# EAGLE design ATSAM11_01 (EAGLE 9.1.0)
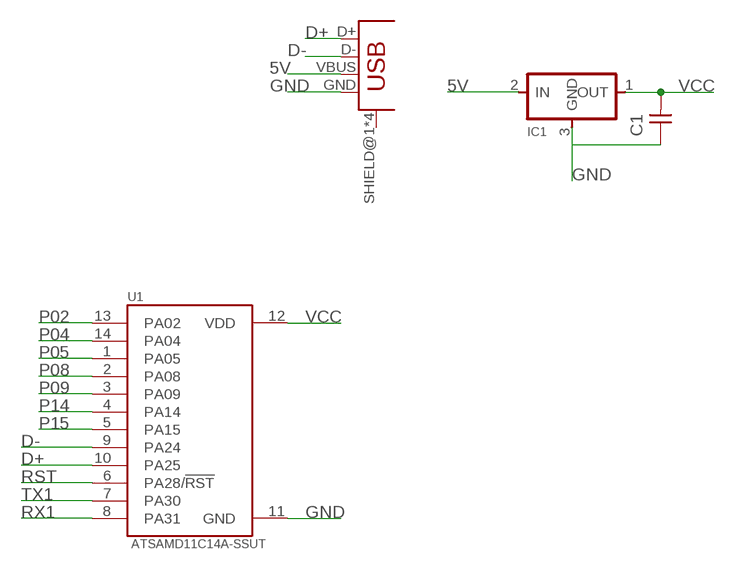
[diagram p0: schematic, sheet 1]

## Parts
C1  CAP-UNPOLARIZED  [C1206]
IC1  VR_REGULATOR-SOT23SOT23  [SOT23]
U1  ATSAMD11C14A-SSUT  [SOIC127P600X160-14N]
U$1  CONN_USB_MINIB  [USB_MINIB]

## Nets
5V: IC1.2(IN) U$1.VBUS
D+: U1.10(PA25) U$1.D+
D-: U1.9(PA24) U$1.D-
GND: C1.1 IC1.3(GND) U1.11(GND) U$1.GND
P02: U1.13(PA02)
P04: U1.14(PA04)
P05: U1.1(PA05)
P08: U1.2(PA08)
P09: U1.3(PA09)
P14: U1.4(PA14)
P15: U1.5(PA15)
RST: U1.6(PA28/!RST)
RX1: U1.8(PA31)
TX1: U1.7(PA30)
VCC: C1.2 IC1.1(OUT) U1.12(VDD)
Unconnected: U$1.SHIELD@1(SHIELD) U$1.SHIELD@2(SHIELD) U$1.SHIELD@3(SHIELD) U$1.SHIELD@4(SHIELD)

## Library data of the parts
C1 = fab:CAP-UNPOLARIZED
IC1 = fab:VR_REGULATOR-SOT23
U1 = ATSAMD11C14A-SSUT:ATSAMD11C14A-SSUT: MCU 32-Bit SAM D11 ARM Cortex M0+ RISC 16KB Flash 1.8V/2.5V/3.3V 14-Pin SOIC T/R; AVAILABILITY: Unavailable; DESCRIPTION: Cortex-M0+, 16KB FLASH, 4KB SRAM, USB - 14 SOIC, INDUSTRIAL, GREEN, 1.6-3.6V, 48MHz/ SOIC .150 _SS_; MF: Microchip; MP: ATSAMD11C14A-SSUT; PACKAGE: SOIC-14 Microchip; PRICE: None
U$1 = fab:CONN_USB_MINIB

## Board
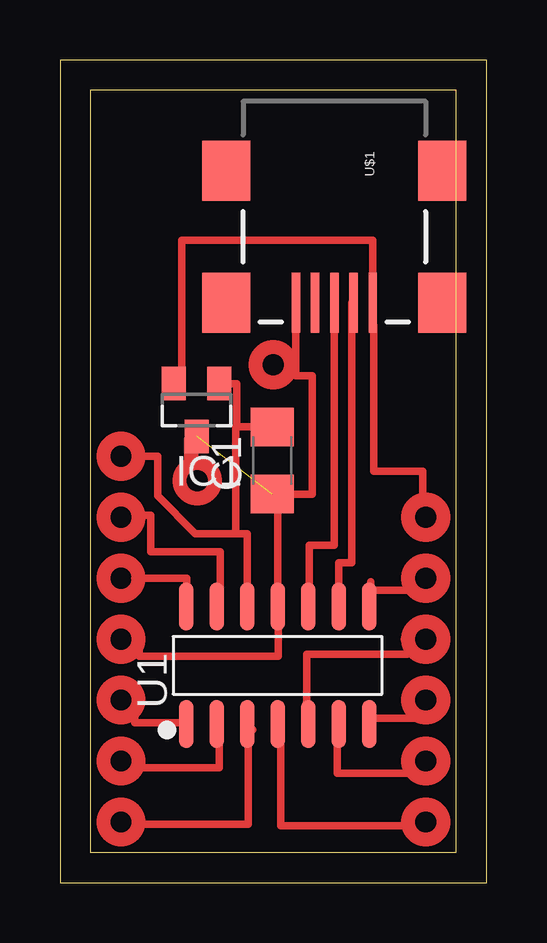
[diagram p1: board, top side]

Size 17.78 x 34.29 mm. Coordinates in mm from the lower left corner, seen from the top.
Outline: 0,0 17.78,0 17.78,34.29 0,34.29 0,0
Copper layers (1*16): Top 0.035mm / dielectric 1.5mm / Bottom 0.035mm
Design rules "default *": minimum track width 10mil, minimum drill 24mil, track to track 16mil, track to pad 16mil, pad to pad 8mil, via to via 8mil, smd to smd 16mil, copper to edge 40mil, drill to drill 8mil, minimum pad ring 10mil, minimum via ring 8mil, stop-mask expansion 4mil, vias tented up to drill 0mil, thermal gap 10mil
Milling: area 1.3,1.3 to 16.5,33

### Footprints (pad centres in the part's own frame; a part is rotated, then mirrored left to right if it is on the bottom)
C1206 = smd 1.6 x 1.8: 1 -1.4,0; 2 1.4,0
SOT23 = smd 1 x 1.4: 1 -0.95,-1.1; 2 0.95,-1.1; 3 0,1.1
SOIC127P600X160-14N = smd 2 x 0.6: 1 -2.45,3.81; 2 -2.45,2.54; 3 -2.45,1.27; 4 -2.45,0; 5 -2.45,-1.27; 6 -2.45,-2.54; 7 -2.45,-3.81; 8 2.45,-3.81; 9 2.45,-2.54; 10 2.45,-1.27; 11 2.45,0; 12 2.45,1.27; 13 2.45,2.54; 14 2.45,3.81
USB_MINIB = smd 2.5 x 0.35: D+ 3.77,0; D- 3.77,0.8; GND 3.77,-1.6; ID 3.77,-0.8; VBUS 3.77,1.6 | smd 2.5 x 2: SHIELD@1 -1.73,-4.5; SHIELD@2 -1.73,4.5; SHIELD@3 3.77,4.5; SHIELD@4 3.77,-4.5

### Placement (x,y rotation side)
C1  8.84,17.6 90 top
IC1  5.69,19.71 180 top
U1  9.07,9.07 90 top
U$1  11.43,27.94 270 top

### Tracks (layer width: path | path; a pad name or v marks a point on that pad's centre or on a via)
5V
  Top 0.305: U$1.VBUS 13.03,26.77 5.08,26.77 | 5.94,26.77 5.08,26.77 | 4.72,20.83 IC1.2 5.08,20.81 5.08,26.77
D+
  Top 0.305: 10.39,11.52 U1.10 10.39,11.52 | U$1.D+ 11.43,14.07 10.39,14.07 10.39,11.52
D-
  Top 0.305: 11.56,11.52 U1.9 11.61,13.34 12.16,13.34 12.16,24.17 U$1.D-
GND  (1 unrouted)
  Top 0.305: U$1.GND 9.83,21.97 | 9.83,21.97 9.83,21.13 10.52,21.13 10.52,16.2 8.99,16.2 | 8.99,16.2 C1.1 | U1.11 9.07,16.2 8.99,16.2 | IC1.3 5.69,19.14 | 9.83,22.09 9.83,21.97
N$1
  Top 0.305: 3.43,2.44 7.85,2.44 7.85,6.63 7.85,6.38 8.03,6.38
N$2
  Top 0.305: 9.2,6.58 9.2,2.39 14.5,2.39
N$3
  Top 0.305: 6.63,6.5 6.63,4.8 3.17,4.8 3.2,4.8 3.2,4.83
N$4
  Top 0.305: 11.56,5.84 11.56,4.57 14.86,4.57
N$5
  Top 0.305: 14.55,7.47 14.55,7.57
N$6
  Top 0.305: 12.83,12.19 14.61,12.19 14.61,12.57
N$7
  Top 0.305: 5.21,6.68 3.12,6.68 3.12,7.11
N$8
  Top 0.305: 12.95,12.06 12.95,12.55
N$9
  Top 0.305: 3.3,9.83 3.3,9.45 3.76,9.45 4.37,9.45 9.09,9.45 9.09,10.74
N$10
  Top 0.305: 5.28,11.86 5.28,12.7 3.12,12.7
N$11
  Top 0.305: 6.68,11.79 6.68,13.79 3.79,13.79 3.79,15.32 3.3,15.32
N$12
  Top 0.305: 12.95,6.86 15.11,6.86
N$13
  Top 0.305: 10.29,7.37 10.29,9.53 14.48,9.53 14.48,10.16 14.35,10.16
N$14
  Top 0.305: 13.08,23.24 13.08,17.14 15.11,17.14 15.11,15.88
N$15
  Top 0.61: 5.46,18.49 5.46,17.71
N$16
  Top 0.305: 3.43,17.78 4.06,17.78 4.06,16.13 5.64,14.55 7.39,14.55
VCC
  Top 0.305: U1.12 7.8,14.55 7.32,14.55 7.32,19 7.37,19 | 7.37,19 C1.2 | 7.37,19 7.37,20.81 IC1.1
(copper drawn outside any net)
  shapes: Top circle x15